# EasyEDA schematic SCH_DHT_projetos_2022-03-18.json
TITLE: Sheet_1; REV: 1.0; Date: 2022-03-18; Sheet: 1/1; Drawn By: GustavoHenrique; Company: Your Company
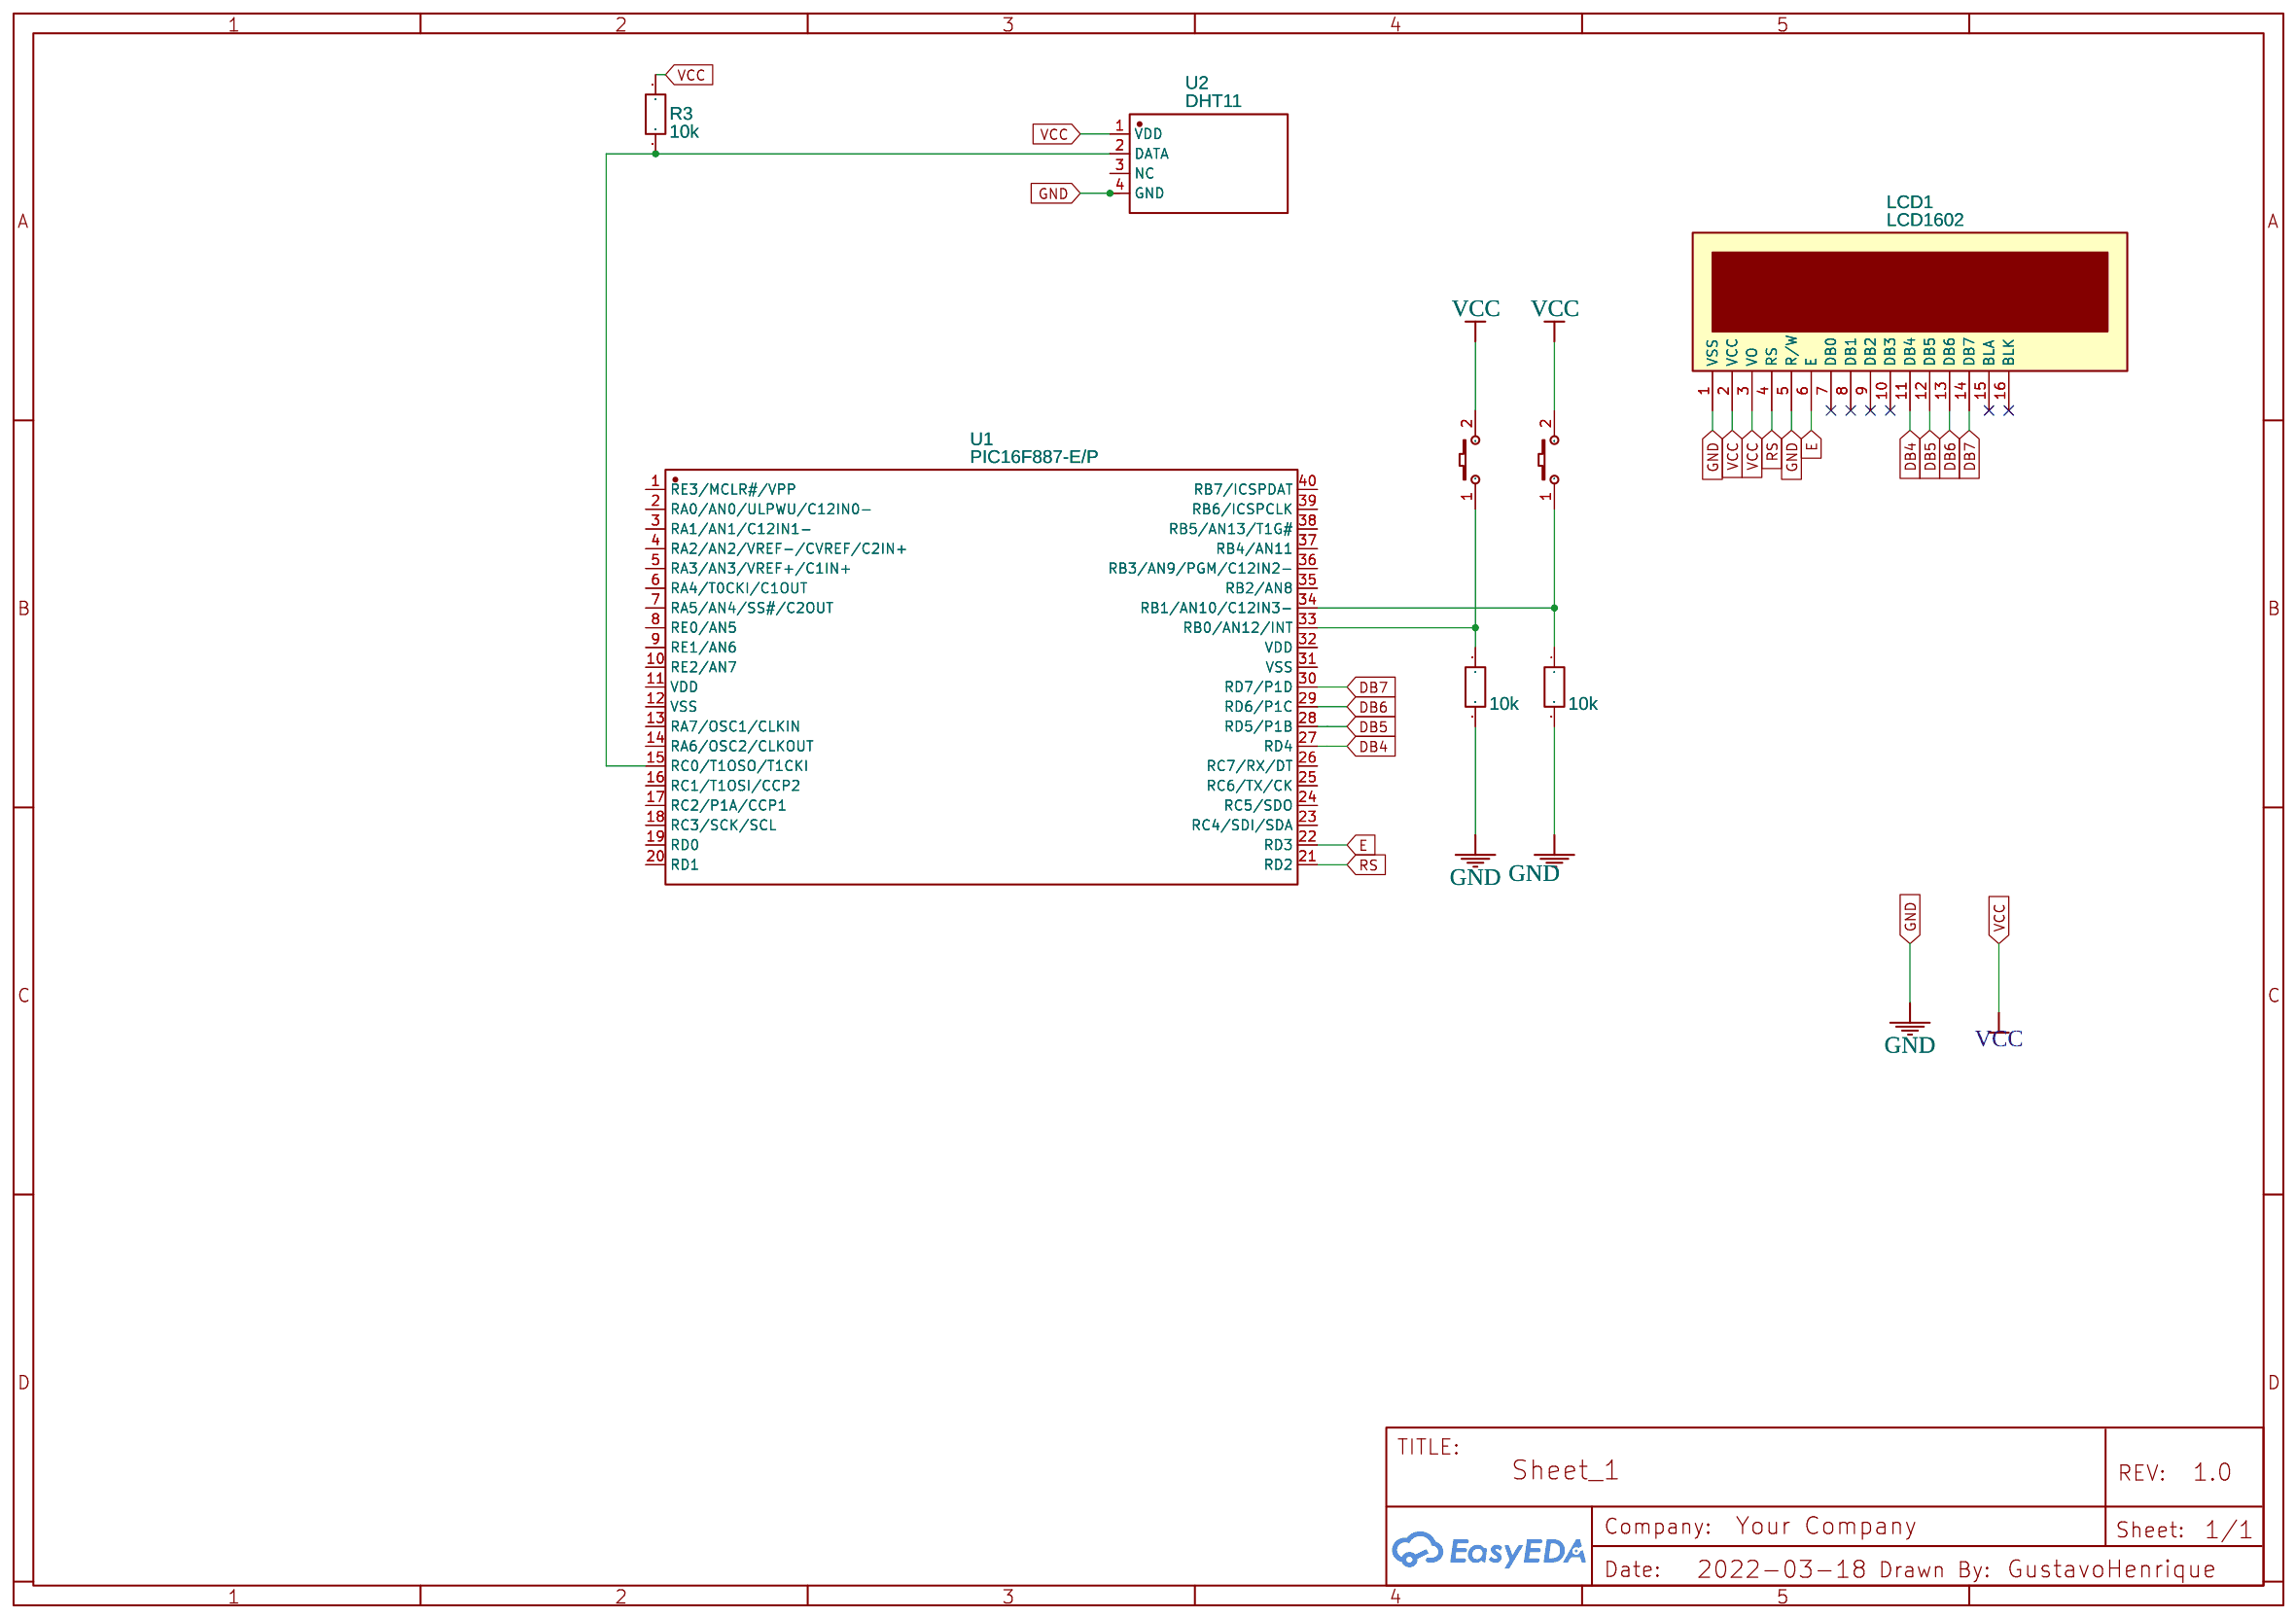
[diagram p0: schematic sheet]

## Parts
KEY1  K2-3.6×6.1_SMD  [KEY-SMD_2P-L6.2-W3.6-LS8.0]
KEY2  K2-3.6×6.1_SMD  [KEY-SMD_2P-L6.2-W3.6-LS8.0]
LCD1  LCD1602  [LCD1602]
R1  10k  [R0603]
R2  10k  [R0603]
R3  10k  [R0603]
U1  PIC16F887-E/P  [PDIP-40_L52.3-W13.8-P2.54-LS15.2-BL]
U2  DHT11  [SENSOR-TH_DHT11]

## Library data of the parts
KEY1 KEY2 = K2-3.6×6.1_SMD: Supplier Part: C118141; Supplier: LCSC; Manufacturer Part: K2-1107ST-A4SW-06; Contributor: LCEDA_Lib; 制造商: 韩国韩荣
LCD1 = LCD1602: Manufacturer: LONTECH(厦门龙特); Manufacturer Part: LCM1602K-NSW-BBW; Supplier Part: C83275; Supplier: LCSC; Contributor: LCEDA_Lib
R1-R3 = R_0603_EU: Contributor: LCEDA_Lib
U1 = PIC16F887-E/P: Supplier: LCSC; Supplier Part: C647863; Manufacturer: Microchip Tech; Contributor: LCSC; JLCPCB Part Class: Extended Part
U2 = DHT11: Supplier: LCSC; Supplier Part: C117051; Manufacturer: Aosong (Guangzhou) Elec; Contributor: LCSC; JLCPCB Part Class: Extended Part

## Nets
GND: LCD1.1(VSS) LCD1.5(R/W) R1.2 R2.2 U2.4(GND)
VCC: KEY1.2 KEY2.2 LCD1.2(VCC) LCD1.3(VO) R3.1 U2.1(VDD)
DB4: LCD1.11(DB4) U1.27(RD4)
DB5: LCD1.12(DB5) U1.28(RD5/P1B)
DB6: LCD1.13(DB6) U1.29(RD6/P1C)
DB7: LCD1.14(DB7) U1.30(RD7/P1D)
E: LCD1.6(E) U1.22(RD3)
RS: LCD1.4(RS) U1.21(RD2)
Net-(KEY1-1): KEY1.1 R1.1 U1.33(RB0/AN12/INT)
Net-(KEY2-1): KEY2.1 R2.1 U1.34(RB1/AN10/C12IN3-)
Net-(R3-2): R3.2 U1.15(RC0/T1OSO/T1CKI) U2.2(DATA)

Not connected (* = marked no-connect by the designer): LCD1 7(DB0)* 8(DB1)* 9(DB2)* 10(DB3)* 15(BLA)* 16(BLK)*; U1 1(RE3/MCLR#/VPP) 2(RA0/AN0/ULPWU/C12IN0-) 3(RA1/AN1/C12IN1-) 4(RA2/AN2/VREF-/CVREF/C2IN+) 5(RA3/AN3/VREF+/C1IN+) 6(RA4/T0CKI/C1OUT) 7(RA5/AN4/SS#/C2OUT) 8(RE0/AN5) 9(RE1/AN6) 10(RE2/AN7) 11(VDD) 12(VSS) 13(RA7/OSC1/CLKIN) 14(RA6/OSC2/CLKOUT) 16(RC1/T1OSI/CCP2) 17(RC2/P1A/CCP1) 18(RC3/SCK/SCL) 19(RD0) 20(RD1) 23(RC4/SDI/SDA) 24(RC5/SDO) 25(RC6/TX/CK) 26(RC7/RX/DT) 31(VSS) 32(VDD) 35(RB2/AN8) 36(RB3/AN9/PGM/C12IN2-) 37(RB4/AN11) 38(RB5/AN13/T1G#) 39(RB6/ICSPCLK) 40(RB7/ICSPDAT); U2 3(NC)
